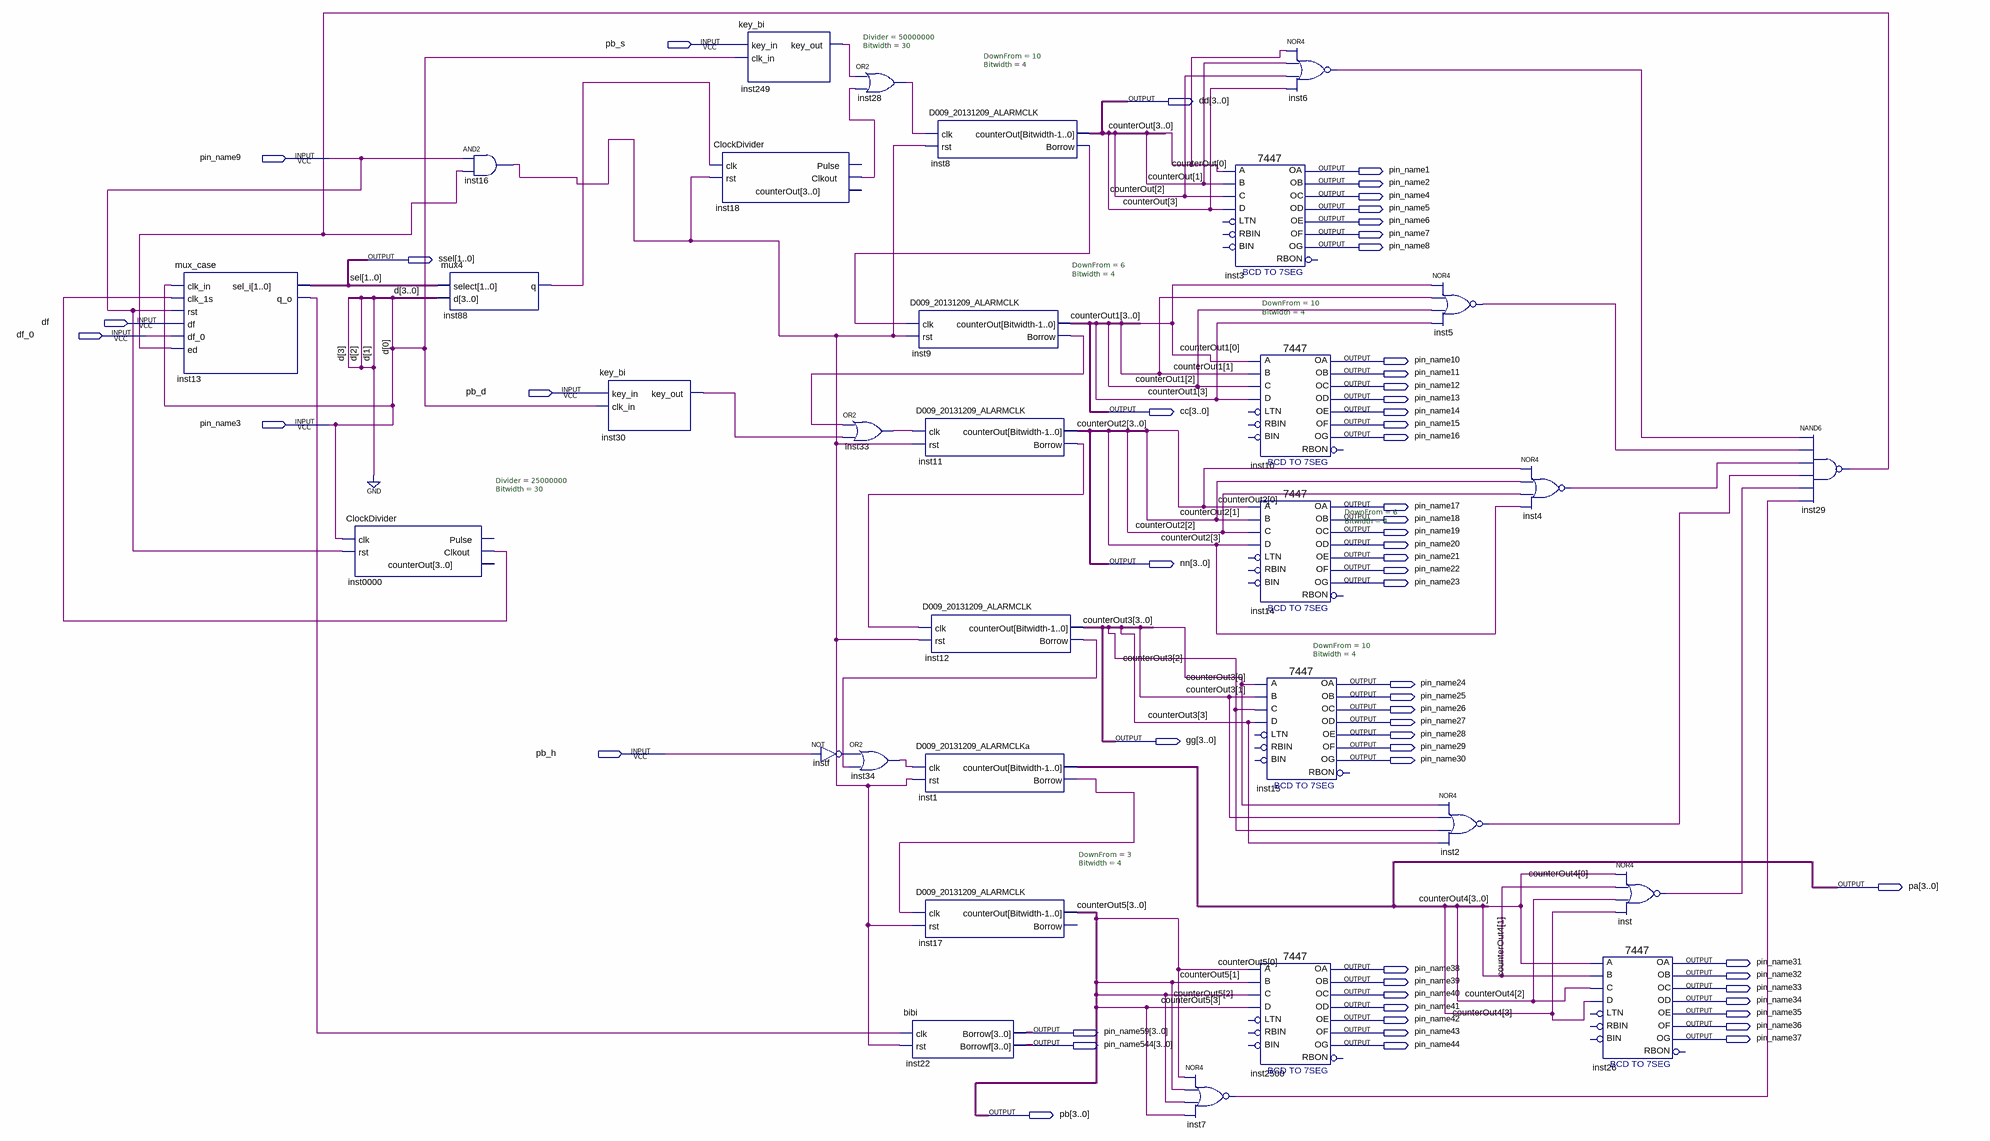
[diagram p0: schematic sheet]
// Quartus schematic Block1.bdf as structural Verilog: 31 symbols, 58 pins
module Block1 (
  input  pb_s,
  input  pin_name9,
  input  df,
  input  df_0,
  input  pb_d,
  input  pin_name3,
  input  pb_h,
  output [3:0] dd,
  output pin_name1,
  output pin_name2,
  output pin_name4,
  output pin_name5,
  output pin_name6,
  output pin_name7,
  output pin_name8,
  output [1:0] ssel,
  output pin_name10,
  output pin_name11,
  output pin_name12,
  output pin_name13,
  output [3:0] cc,
  output pin_name14,
  output pin_name15,
  output pin_name16,
  output pin_name17,
  output pin_name18,
  output pin_name19,
  output pin_name20,
  output pin_name21,
  output [3:0] nn,
  output pin_name22,
  output pin_name23,
  output pin_name24,
  output pin_name25,
  output pin_name26,
  output pin_name27,
  output pin_name28,
  output [3:0] gg,
  output pin_name29,
  output pin_name30,
  output [3:0] pa,
  output pin_name31,
  output pin_name38,
  output pin_name32,
  output pin_name39,
  output pin_name33,
  output pin_name40,
  output pin_name34,
  output pin_name41,
  output pin_name35,
  output pin_name42,
  output pin_name36,
  output [3:0] pin_name59,
  output pin_name43,
  output pin_name37,
  output [3:0] pin_name544,
  output pin_name44,
  output [3:0] pb
);

  wire inst0000_clkout, inst1_borrow, inst2_out, inst4_out, inst5_out, inst6_out, inst7_out, inst8_borrow,
       inst9_borrow, inst11_borrow, inst12_borrow, inst13_q_o, inst16_out, inst18_clkout, inst28_out,
       inst29_out, inst30_key_out, inst33_out, inst34_out, inst88_q, inst249_key_out, inst_out, instf_out;

  mux_case inst13 (
    .clk_in(pin_name3), .clk_1s(inst0000_clkout), .rst(pin_name9), .df(df), .df_0(df_0), .ed(inst29_out),
    .sel_i(ssel), .q_o(inst13_q_o));
  ClockDivider #(.Divider(25000000), .Bitwidth(30)) inst0000 (
    .clk(pin_name3), .rst(pin_name9), .Clkout(inst0000_clkout));  // open: Pulse, counterOut
  and inst16 (inst16_out, pin_name9, inst29_out);
  mux4 inst88 (.select(ssel), .d({3'b000, pin_name3}), .q(inst88_q));
  key_bi inst30 (.key_in(pb_d), .clk_in(pin_name3), .key_out(inst30_key_out));
  key_bi inst249 (.key_in(pb_s), .clk_in(pin_name3), .key_out(inst249_key_out));
  ClockDivider #(.Divider(50000000), .Bitwidth(30)) inst18 (
    .clk(inst88_q), .rst(inst16_out), .Clkout(inst18_clkout));  // open: Pulse, counterOut
  not instf (instf_out, pb_h);
  or inst28 (inst28_out, inst249_key_out, inst18_clkout);
  or inst33 (inst33_out, inst9_borrow, inst30_key_out);
  or inst34 (inst34_out, instf_out, inst12_borrow);
  D009_20131209_ALARMCLK #(.DownFrom(10), .Bitwidth(4)) inst8 (
    .clk(inst28_out), .rst(inst16_out), .counterOut(dd), .Borrow(inst8_borrow));
  D009_20131209_ALARMCLK #(.DownFrom(6), .Bitwidth(4)) inst9 (
    .clk(inst8_borrow), .rst(inst16_out), .counterOut(cc), .Borrow(inst9_borrow));
  D009_20131209_ALARMCLK #(.DownFrom(10), .Bitwidth(4)) inst11 (
    .clk(inst33_out), .rst(inst16_out), .counterOut(nn), .Borrow(inst11_borrow));
  D009_20131209_ALARMCLK #(.DownFrom(6), .Bitwidth(4)) inst12 (
    .clk(inst11_borrow), .rst(inst16_out), .counterOut(gg), .Borrow(inst12_borrow));
  D009_20131209_ALARMCLKa #(.DownFrom(10), .Bitwidth(4)) inst1 (
    .clk(inst34_out), .rst(inst16_out), .counterOut(pa), .Borrow(inst1_borrow));
  D009_20131209_ALARMCLK #(.DownFrom(3), .Bitwidth(4)) inst17 (
    .clk(inst1_borrow), .rst(inst16_out), .counterOut(pb));  // open: Borrow
  bibi inst22 (.clk(inst13_q_o), .rst(inst16_out), .Borrow(pin_name59), .Borrowf(pin_name544));
  nor inst7 (inst7_out, pb[0], pb[1], pb[2], pb[3]);
  \7447  inst3 (
    .B(dd[1]), .C(dd[2]), .D(dd[3]), .A(dd[0]), .OB(pin_name2), .OC(pin_name4), .OE(pin_name6),
    .OD(pin_name5), .OF(pin_name7), .OG(pin_name8), .OA(pin_name1));  // open: LTN, RBIN, BIN, RBON
  nor inst6 (inst6_out, dd[0], dd[1], dd[2], dd[3]);
  \7447  inst10 (
    .B(cc[1]), .C(cc[2]), .D(cc[3]), .A(cc[0]), .OB(pin_name11), .OC(pin_name12), .OE(pin_name14),
    .OD(pin_name13), .OF(pin_name15), .OG(pin_name16), .OA(pin_name10));  // open: LTN, RBIN, BIN, RBON
  \7447  inst14 (
    .B(nn[1]), .C(nn[2]), .D(nn[3]), .A(nn[0]), .OB(pin_name18), .OC(pin_name19), .OE(pin_name21),
    .OD(pin_name20), .OF(pin_name22), .OG(pin_name23), .OA(pin_name17));  // open: LTN, RBIN, BIN, RBON
  \7447  inst15 (
    .B(gg[1]), .C(gg[2]), .D(gg[3]), .A(gg[0]), .OB(pin_name25), .OC(pin_name26), .OE(pin_name28),
    .OD(pin_name27), .OF(pin_name29), .OG(pin_name30), .OA(pin_name24));  // open: LTN, RBIN, BIN, RBON
  \7447  inst2500 (
    .B(pb[1]), .C(pb[2]), .D(pb[3]), .A(pb[0]), .OB(pin_name39), .OC(pin_name40), .OE(pin_name42),
    .OD(pin_name41), .OF(pin_name43), .OG(pin_name44), .OA(pin_name38));  // open: LTN, RBIN, BIN, RBON
  nor inst5 (inst5_out, cc[0], cc[1], cc[2], cc[3]);
  nor inst2 (inst2_out, gg[0], gg[1], gg[2], gg[3]);
  nor inst4 (inst4_out, nn[0], nn[1], nn[2], nn[3]);
  \7447  inst26 (
    .B(pa[1]), .C(pa[2]), .D(pa[3]), .A(pa[0]), .OB(pin_name32), .OC(pin_name33), .OE(pin_name35),
    .OD(pin_name34), .OF(pin_name36), .OG(pin_name37), .OA(pin_name31));  // open: LTN, RBIN, BIN, RBON
  nor inst (inst_out, pa[0], pa[1], pa[2], pa[3]);
  nand inst29 (inst29_out, inst6_out, inst5_out, inst4_out, inst2_out, inst_out, inst7_out);

  // Other names for the same wires on the sheet: counterOut1[3:0] = cc; counterOut5[3:0] = pb; counterOut[3:0] = dd;
  //   counterOut3[3:0] = gg; counterOut2[3:0] = nn; counterOut4[3:0] = pa; d[0] = pin_name3; sel[1:0] = ssel
endmodule
